# EAGLE design input_board (EAGLE 5.04)
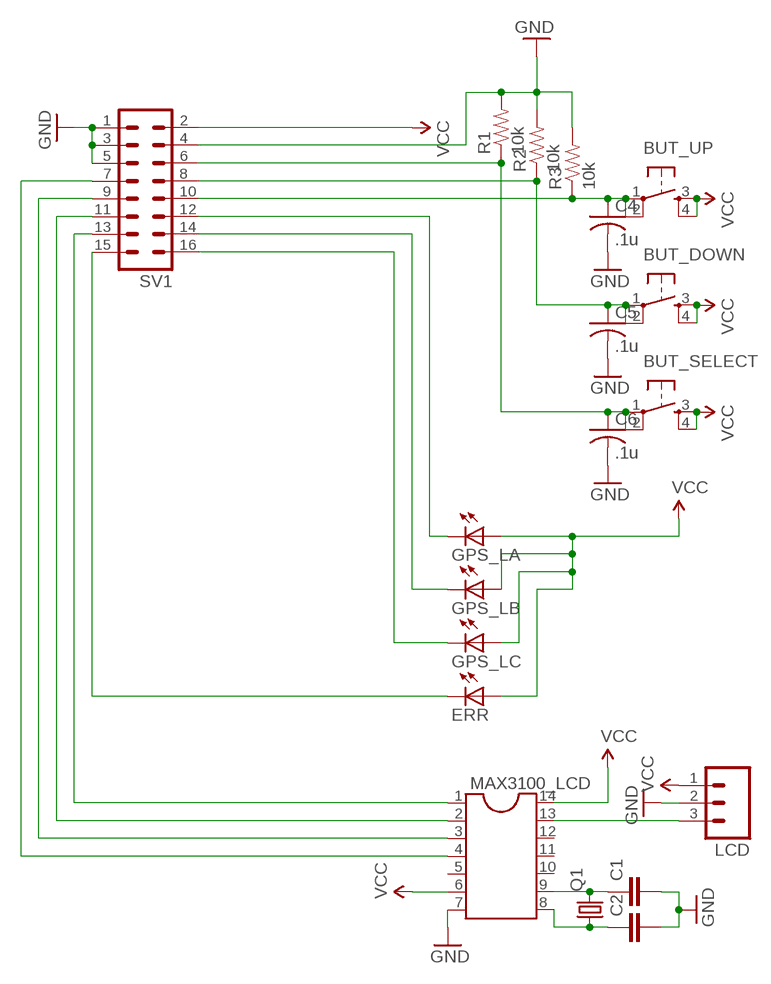
[diagram p0: schematic, sheet 1]

## Parts
BUT_DOWN  TAC_SWITCHPTH  [TACTILE-PTH]
BUT_SELECT  TAC_SWITCHPTH  [TACTILE-PTH]
BUT_UP  TAC_SWITCHPTH  [TACTILE-PTH]
C1  C2,5-3  [C2.5-3]
C2  C2,5-3  [C2.5-3]
C4  .1u  C-US050-025X075  [C050-025X075]
C5  .1u  C-US050-025X075  [C050-025X075]
C6  .1u  C-US050-025X075  [C050-025X075]
ERR  LED3MM  [LED3MM]
GPS_LA  LED3MM  [LED3MM]
GPS_LB  LED3MM  [LED3MM]
GPS_LC  LED3MM  [LED3MM]
LCD  M03PTH  [1X03]
MAX3100_LCD  DIL14S  [SOCKET-14]
Q1  CRYSTALHC49US  [HC49US]
R1  10k  RESISTORPTH1  [AXIAL-0.3]
R2  10k  RESISTORPTH1  [AXIAL-0.3]
R3  10k  RESISTORPTH1  [AXIAL-0.3]
SV1  MA08-2  [MA08-2]

## Nets
GND: C1.2 C2.2 C4.2 C5.2 C6.2 LCD.2 MAX3100_LCD.7 R1.P$2 R2.P$2 R3.P$2 SV1.1 SV1.3 SV1.4 SV1.5
N$4: BUT_DOWN.1 BUT_DOWN.2 C5.1 R2.P$1 SV1.8
N$5: BUT_SELECT.1 BUT_SELECT.2 C6.1 R1.P$1 SV1.6
N$7: BUT_UP.1 BUT_UP.2 C4.1 R3.P$1 SV1.10
N$8: C2.1 MAX3100_LCD.8 Q1.1
N$9: C1.1 MAX3100_LCD.9 Q1.2
N$10: LCD.3 MAX3100_LCD.13
N$11: GPS_LA.K(C) SV1.12
N$12: GPS_LB.K(C) SV1.14
N$13: GPS_LC.K(C) SV1.16
N$14: ERR.K(C) SV1.15
N$15: MAX3100_LCD.1 SV1.13
N$16: MAX3100_LCD.2 SV1.11
N$17: MAX3100_LCD.3 SV1.9
N$18: MAX3100_LCD.4 SV1.7
VCC: BUT_DOWN.3 BUT_DOWN.4 BUT_SELECT.3 BUT_SELECT.4 BUT_UP.3 BUT_UP.4 ERR.A GPS_LA.A GPS_LB.A GPS_LC.A LCD.1 MAX3100_LCD.6 MAX3100_LCD.14 SV1.2
Unconnected: MAX3100_LCD.5 MAX3100_LCD.10 MAX3100_LCD.11 MAX3100_LCD.12

## Library data of the parts
BUT_DOWN BUT_SELECT BUT_UP = SparkFun:TAC_SWITCH: Momentary Switch Button commonly used for reset or general input. Spark Fun Electronics SKU : COM-00097
C1 C2 = capacitor-wima:C: CAPACITOR naming: grid - package width
C4-C6 = rcl:C-US: CAPACITOR, American symbol
ERR GPS_LA GPS_LB GPS_LC = SparkFun:LED: LEDs Standard schematic elements and footprints for 5mm, 3mm, 1206, and 0603 sized LEDs. 5mm - Spark Fun Electronics SKU : COM-00529 (and others)
LCD = SparkFun:M03: Header 3 Standard 3-pin 0.1" header. Use with straight break away headers (SKU : PRT-00116), right angle break away headers (PRT-00553), swiss pins (PRT-00743), machine pins (PRT-00117), and female headers (PRT-00115). Molex polarized connector foot print use with SKU : PRT-08232 with associated crimp pins and housings.
MAX3100_LCD = ic-package:DIL14: Dual In Line / Socket
Q1 = SparkFun:CRYSTAL: Crystals Various standard crystals. Proven footprints. Spark Fun Electronics SKU : COM-00534
R1-R3 = SparkFun:RESISTOR: Resistor Basic schematic elements and footprints for 0603, 1206, and PTH 1/10th watt (small) resistors.
SV1 = con-lstb:MA08-2: PIN HEADER

## Board
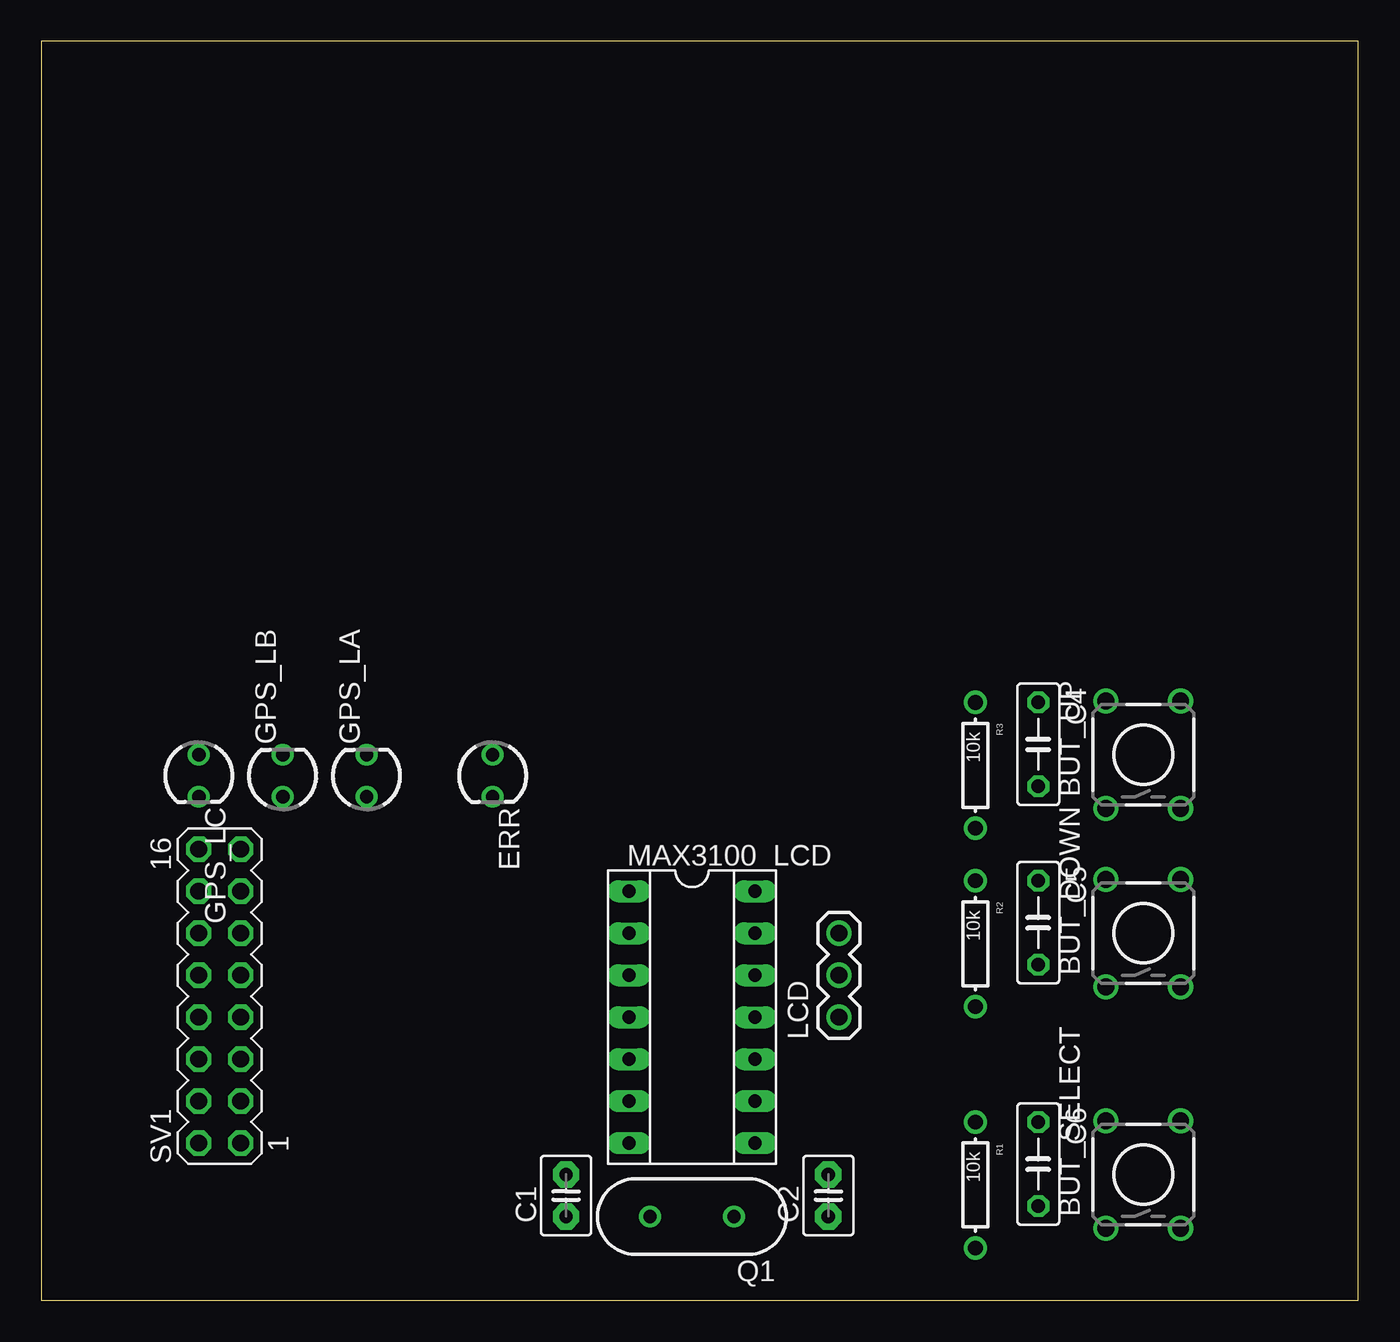
[diagram p1: board, top side]
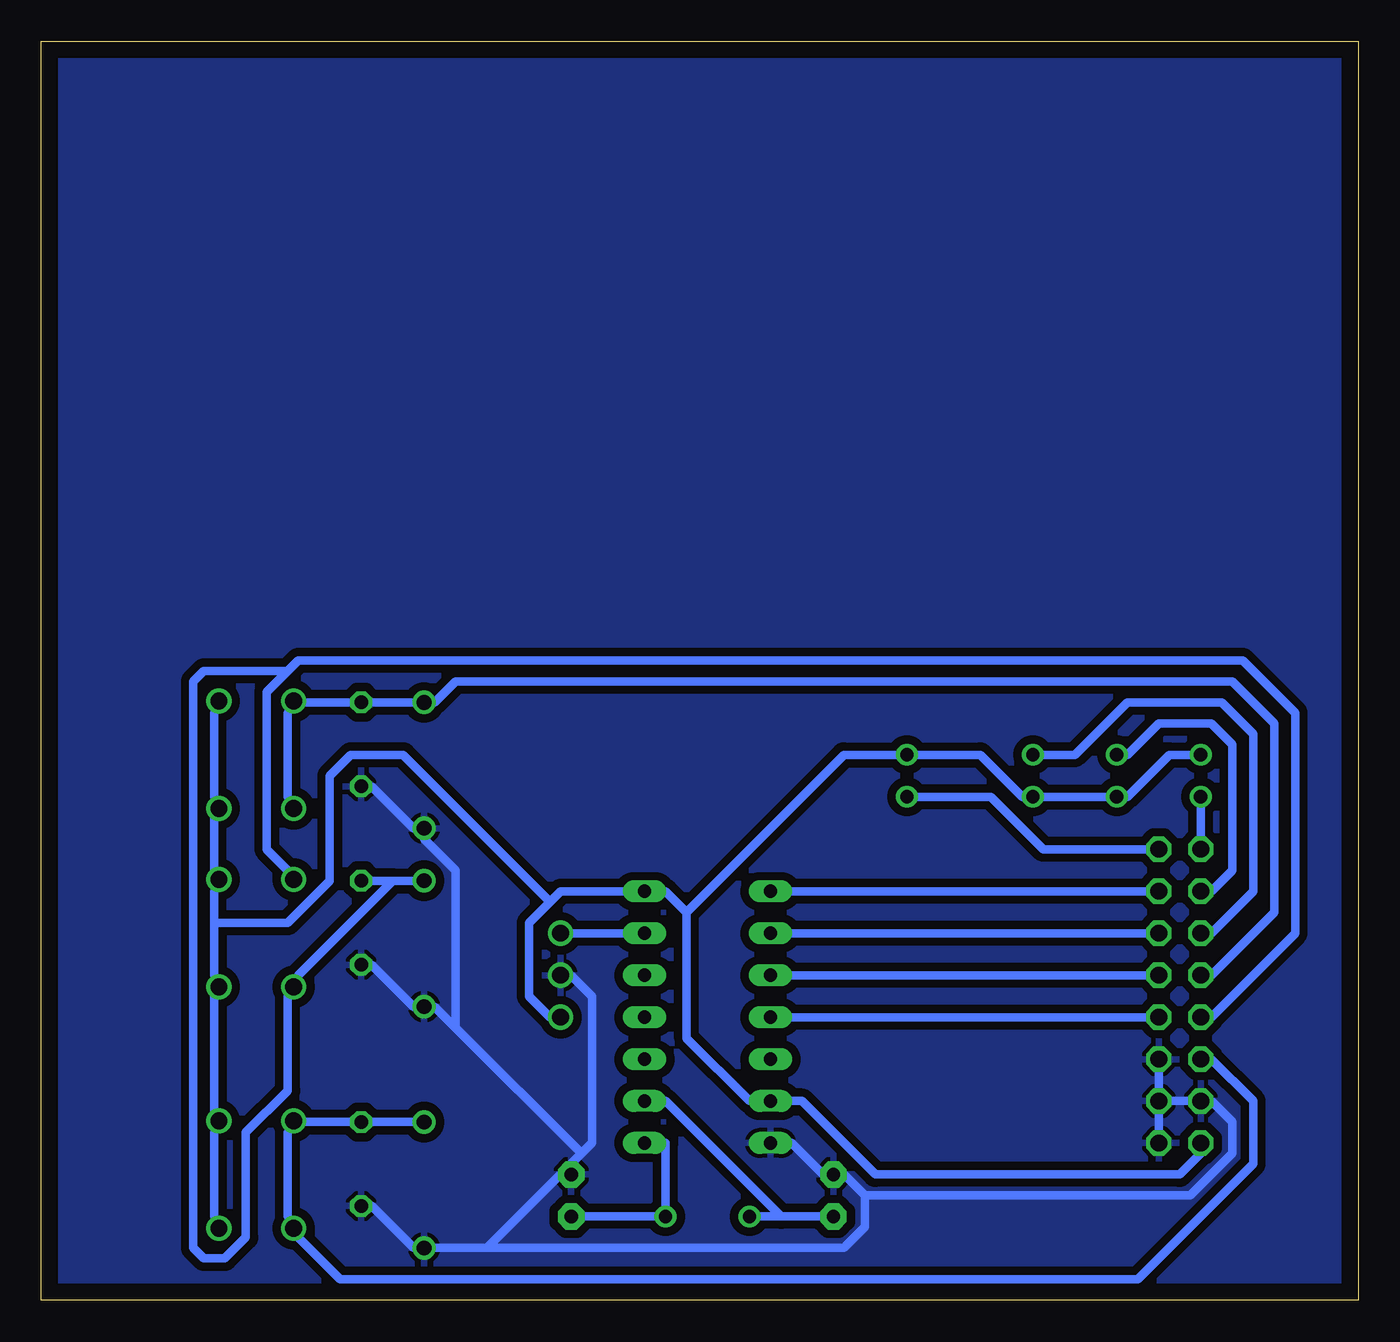
[diagram p2: board, bottom side, seen from below]

Size 79.68 x 76.19 mm. Coordinates in mm from the lower left corner, seen from the top.
Outline: 0,0 79.68,0 79.68,76.19 0,76.19 0,0
Copper layers (1*16): Top 0mm / dielectric 1.5mm / Bottom 0.035mm
Design rules "default *": minimum track width 20mil, minimum drill 24mil, track to track 20mil, track to pad 20mil, pad to pad 8mil, via to via 8mil, smd to smd 8mil, copper to edge 40mil, drill to drill 8mil, minimum pad ring 10mil, minimum via ring 8mil, stop-mask expansion 4mil, vias tented up to drill 0mil, thermal gap 10mil

### Footprints (pad centres in the part's own frame; a part is rotated, then mirrored left to right if it is on the bottom)
TACTILE-PTH = drill 1.016 round: 1 -3.251,2.261; 2 3.251,2.261; 3 -3.251,-2.261; 4 3.251,-2.261
C2.5-3 = drill 0.813 pad 1.6 octagon: 1 -1.27,0; 2 1.27,0
C050-025X075 = drill 0.813 octagon: 1 -2.54,0; 2 2.54,0
LED3MM = drill 0.813 round: A -1.27,0; K 1.27,0
1X03 = drill 1.016 round: 1 0,0; 2 2.54,0; 3 5.08,0
SOCKET-14 = drill 0.813 long: 1 -7.62,-3.81; 2 -5.08,-3.81; 3 -2.54,-3.81; 4 0,-3.81; 5 2.54,-3.81; 6 5.08,-3.81; 7 7.62,-3.81; 8 7.62,3.81; 9 5.08,3.81; 10 2.54,3.81; 11 0,3.81; 12 -2.54,3.81; 13 -5.08,3.81; 14 -7.62,3.81
HC49US = drill 0.813 round: 1 -2.54,0; 2 2.54,0
AXIAL-0.3 = drill 0.9 round: P$1 -3.81,0; P$2 3.81,0
MA08-2 = drill 1.016 octagon: 1 -8.89,-1.27; 2 -8.89,1.27; 3 -6.35,-1.27; 4 -6.35,1.27; 5 -3.81,-1.27; 6 -3.81,1.27; 7 -1.27,-1.27; 8 -1.27,1.27; 9 1.27,-1.27; 10 1.27,1.27; 11 3.81,-1.27; 12 3.81,1.27; 13 6.35,-1.27; 14 6.35,1.27; 15 8.89,-1.27; 16 8.89,1.27

### Placement (x,y rotation side)
BUT_DOWN  66.67,22.23 90 top
BUT_SELECT  66.67,7.62 90 top
BUT_UP  66.67,33.02 90 top
C1  31.75,6.35 90 top
C2  47.62,6.35 90 top
C4  60.33,33.66 270 top
C5  60.33,22.86 270 top
C6  60.33,8.26 270 top
ERR  27.3,31.75 270 top
GPS_LA  19.68,31.75 90 top
GPS_LB  14.61,31.75 90 top
GPS_LC  9.53,31.75 270 top
LCD  48.26,17.14 90 top
MAX3100_LCD  39.37,17.14 270 top
Q1  39.37,5.08 180 top
R1  56.52,6.99 270 top
R2  56.52,21.59 270 top
R3  56.52,32.38 270 top
SV1  10.79,18.41 90 top

### Tracks (layer width: path | path; a pad name or v marks a point on that pad's centre or on a via)
GND
  Bottom 0.508: C4.2 59.69,31.11 57.15,28.57 R3.P$2 56.52,27.94 54.61,26.04 54.61,16.51 | C5.2 59.69,20.32 57.15,17.78 R2.P$2 55.88,17.78 54.61,16.51 | 46.99,8.89 47.62,8.26 C2.2 48.26,7.62 52.7,3.17 | 46.99,8.89 46.35,9.53 46.35,18.41 47.62,19.68 LCD.2 | 46.99,8.89 54.61,16.51 | SV1.3 SV1.4 8.89,12.06 7.62,10.79 7.62,8.89 10.16,6.35 29.84,6.35 | SV1.3 SV1.1 | SV1.3 SV1.5 | MAX3100_LCD.7 34.29,9.53 32.38,7.62 C1.2 31.11,7.62 29.84,6.35 | C6.2 59.69,5.71 57.15,3.17 R1.P$2 52.7,3.17 | 29.84,6.35 29.84,4.45 31.11,3.17 52.7,3.17
  pour Bottom: 0,76.2 79.38,76.2 79.38,0 0,0
N$1
  pour Bottom: 0,76.2 79.38,76.2 79.38,0 0,0
N$4
  Bottom 0.508: 58.42,25.4 C5.1 | 58.42,25.4 R2.P$1 | 58.42,25.4 64.14,19.68 BUT_DOWN.1 64.77,18.41 64.77,12.7 67.31,10.16 67.31,3.81 68.58,2.54 69.85,2.54 70.48,3.17 70.48,37.47 69.85,38.1 64.77,38.1 | 64.77,38.1 66.04,36.83 66.04,27.3 64.77,26.04 BUT_DOWN.2 | 64.77,38.1 64.14,38.73 6.99,38.73 3.81,35.56 3.81,22.23 8.89,17.14 SV1.8
N$5
  Bottom 0.508: R1.P$1 C6.1 64.14,10.79 BUT_SELECT.2 64.77,10.16 64.77,5.08 BUT_SELECT.1 64.14,3.81 61.59,1.27 13.34,1.27 6.35,8.26 6.35,12.06 8.89,14.61 SV1.6
N$7
  Bottom 0.508: BUT_UP.1 64.77,30.48 64.77,35.56 BUT_UP.2 64.14,36.2 C4.1 R3.P$1 55.88,36.2 54.61,37.47 7.62,37.47 5.08,34.92 5.08,23.5 8.89,19.68 SV1.10
N$8
  Bottom 0.508: MAX3100_LCD.8 41.91,9.53 Q1.1 C2.1
N$9
  Bottom 0.508: 34.92,5.08 Q1.2 | C1.1 34.92,5.08 | 34.92,5.08 41.91,12.06 MAX3100_LCD.9
N$10
  Bottom 0.508: MAX3100_LCD.13 LCD.3
N$11
  Bottom 0.508: GPS_LA.K 17.14,33.02 13.97,36.2 8.26,36.2 6.35,34.29 6.35,24.77 8.89,22.23 SV1.12
N$12
  Bottom 0.508: GPS_LB.K 13.97,33.02 12.06,34.92 8.89,34.92 7.62,33.66 7.62,26.04 8.89,24.77 SV1.14
N$13
  Bottom 0.508: SV1.16 GPS_LC.K
N$14
  Bottom 0.508: ERR.K 22.23,30.48 19.05,27.3 SV1.15
N$15
  Bottom 0.508: SV1.13 MAX3100_LCD.1
N$16
  Bottom 0.508: SV1.11 MAX3100_LCD.2
N$17
  Bottom 0.508: SV1.9 MAX3100_LCD.3
N$18
  Bottom 0.508: SV1.7 MAX3100_LCD.4
VCC
  Bottom 0.508: BUT_SELECT.3 69.22,5.08 69.22,10.16 BUT_SELECT.4 69.22,11.43 69.22,18.41 BUT_DOWN.3 69.22,19.68 69.22,22.86 | 69.22,22.86 69.22,24.77 BUT_DOWN.4 69.22,26.04 69.22,29.21 BUT_UP.3 69.22,30.48 69.22,35.56 BUT_UP.4 | GPS_LC.A 11.43,33.02 13.97,30.48 GPS_LB.A GPS_LA.A 20.32,30.48 22.86,33.02 ERR.A 31.11,33.02 40.64,23.5 | 40.64,23.5 40.64,15.88 36.83,12.06 MAX3100_LCD.6 33.66,12.06 29.21,7.62 10.79,7.62 9.53,8.89 SV1.2 | 40.64,23.5 41.91,24.77 MAX3100_LCD.14 48.26,24.77 48.9,24.13 | 48.9,24.13 50.16,22.86 50.16,18.41 48.9,17.14 LCD.1 | 69.22,22.86 64.77,22.86 62.23,25.4 62.23,31.75 60.96,33.02 57.78,33.02 48.9,24.13